# Altium schematic sheet FDCAN&QSPI.SchDoc: FDCAN & QSPI
size A4; DocumentNumber: MB1246; Revision: B.1; SheetNumber: 11; SheetTotal: 17; Project: STM32H7xxI-EVAL
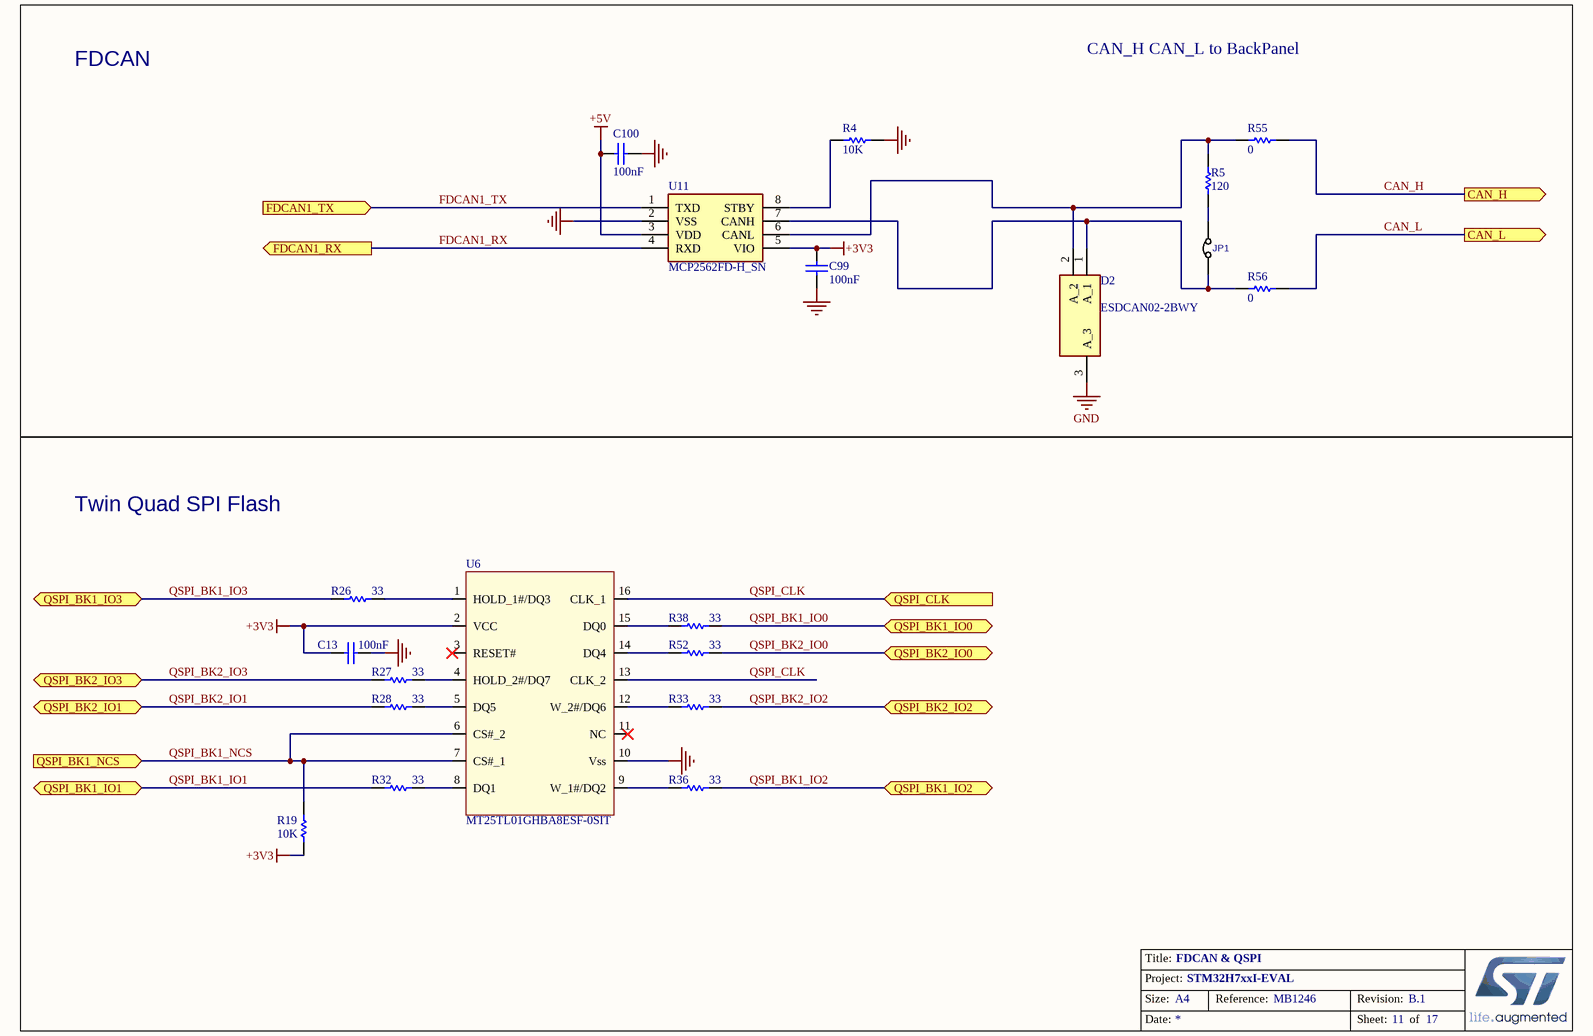
[diagram p0: FDCAN&QSPI.SchDoc]

## Parts
C13  100nF  [C0603E]
C99  100nF  [C0603E]
C100  100nF  [C0603E]
D2  ESDCAN02-2BWY  [SOT65P210X110-3N]
JP1  JMPSOLDER  [HDR1X2]  (value not drawn)
R4  10K  [R0603E]
R5  120  [R0603E]
R19  10K  [R0603E]
R26  33  [R0603E]
R27  33  [R0603E]
R28  33  [R0603E]
R32  33  [R0603E]
R33  33  [R0603E]
R36  33  [R0603E]
R38  33  [R0603E]
R52  33  [R0603E]
R55  0  [R0603E]
R56  0  [R0603E]
U6  MT25TL01GHBA8ESF-0SIT  [SOIC127P1032X265-16N]
U11  MCP2562FD-H_SN  [SOIC127P600X175-8N]

## Ports
CAN_H (out), CAN_L (out), FDCAN1_RX (out), FDCAN1_TX (in), QSPI_BK1_IO0 (bidir), QSPI_BK1_IO1 (bidir), QSPI_BK1_IO2 (bidir), QSPI_BK1_IO3 (bidir), QSPI_BK1_NCS (in), QSPI_BK2_IO0 (bidir), QSPI_BK2_IO1 (bidir), QSPI_BK2_IO2 (bidir), QSPI_BK2_IO3 (bidir), QSPI_CLK (in)

## Nets
+3V3: C13.1 C99.1 R19.2 U6.2(VCC) U11.5(VIO)
+5V: C100.1 U11.3(VDD)
GND: C13.2 C99.2 C100.2 D2.3(A_3) R4.2 U6.10(Vss) U11.2(VSS)
CAN_H: R55.1 ; port CAN_H
CAN_L: R56.1 ; port CAN_L
FDCAN1_RX: U11.4(RXD) ; port FDCAN1_RX
FDCAN1_TX: U11.1(TXD) ; port FDCAN1_TX
QSPI_BK1_IO0: R38.1 ; port QSPI_BK1_IO0
QSPI_BK1_IO1: R32.2 ; port QSPI_BK1_IO1
QSPI_BK1_IO2: R36.1 ; port QSPI_BK1_IO2
QSPI_BK1_IO3: R26.2 ; port QSPI_BK1_IO3
QSPI_BK1_NCS: R19.1 U6.6(CS#_2) U6.7(CS#_1) ; port QSPI_BK1_NCS
QSPI_BK2_IO0: R52.1 ; port QSPI_BK2_IO0
QSPI_BK2_IO1: R28.2 ; port QSPI_BK2_IO1
QSPI_BK2_IO2: R33.1 ; port QSPI_BK2_IO2
QSPI_BK2_IO3: R27.2 ; port QSPI_BK2_IO3
QSPI_CLK: U6.13(CLK_2) U6.16(CLK_1) ; port QSPI_CLK
NetD2_1: D2.1(A_1) JP1.1 R56.2 U11.7(CANH)
NetD2_2: D2.2(A_2) R5.2 R55.2 U11.6(CANL)
NetJP1_2: JP1.2 R5.1
NetR4_1: R4.1 U11.8(STBY)
NetR26_1: R26.1 U6.1(HOLD_1#/DQ3)
NetR27_1: R27.1 U6.4(HOLD_2#/DQ7)
NetR28_1: R28.1 U6.5(DQ5)
NetR32_1: R32.1 U6.8(DQ1)
NetR33_2: R33.2 U6.12(W_2#/DQ6)
NetR36_2: R36.2 U6.9(W_1#/DQ2)
NetR38_2: R38.2 U6.15(DQ0)
NetR52_2: R52.2 U6.14(DQ4)

Not connected (* = marked no-connect by the designer): U6 3(RESET#)* 11(NC)*

## Notes on the sheet
- FDCAN
- CAN_H CAN_L to BackPanel
- Twin Quad SPI Flash
- Title:
- Project:
- Size:
- Date:
- A4
- Reference:
- Sheet:
- Revision:
- of

## Library data of the parts
C13 = Cap: Capacitor; Value: 10nF; Ordered by: Subcon; Published: 8-Jun-2000; Revision: July-2002: Re-released for DXP Platform.; Publisher: Altium Limited
C99 C100 = Cap: Capacitor; Value: 10nF; Published: 8-Jun-2000; Revision: July-2002: Re-released for DXP Platform.; Publisher: Altium Limited
D2 = ESDCAN02-2BWY: TVS Diode (Bi-directional); Manufacturer_Name: STMicroelectronics; Datasheet Link: https://www.st.com/resource/en/datasheet/esdcan02-2bwy.pdf; Height: 1.1mm; Manufacturer_Part_Number: ESDCAN02-2BWY; Mouser Part Number: 511-ESDCAN02-2BWY; Mouser Price/Stock: https://www.mouser.co.uk/ProductDetail/STMicroelectronics/ESDCAN02-2BWY?qs=FqY30PPN9V14rBXzBYhRkA%3D%3D; Arrow Part Number: ESDCAN02-2BWY; Arrow Price/Stock: https://www.arrow.com/en/products/esdcan02-2bwy/stmicroelectronics?region=nac
JP1 = JUMPER_SOLDER: JUMPER, HEADER 2PIN; MANF: MANF; MANF_P#: MANF_P#; VALUE: JMPSOLDER
R4 R26-R28 R32 R33 R36 R38 R52 = Res1: Resistor; Value: 1K; Published: 8-Jun-2000; Revision: July-2002: Re-released for DXP Platform.; Publisher: Altium Limited
R5 R55 R56 = res1: Resistor; Value: 1K; Published: 8-Jun-2000; Revision: July-2002: Re-released for DXP Platform.; Publisher: Altium Limited
R19 = res1: Resistor; Value: 1K; Ordered by: Subcon; Published: 8-Jun-2000; Revision: July-2002: Re-released for DXP Platform.; Publisher: Altium Limited
U6 = MT25TL01GHBA8ESF-0SIT: Serial NOR Flash Memory; ECCN_US/EU: 3A991
U11 = MCP2562FD-H_SN: Integrated Circuit; Manufacturer_Name: Microchip; Manufacturer_Part_Number: MCP2562FD-H/SN; Datasheet Link: http://www.microchip.com/mymicrochip/filehandler.aspx?ddocname=en568915; Height: 1.75mm; Mouser Part Number: 579-MCP2562FD-H/SN; Mouser Price/Stock: https://www.mouser.co.uk/ProductDetail/Microchip-Technology/MCP2562FD-H-SN?qs=YlpJWyuQ3POk3KZHoNA6vA%3D%3D; Arrow Part Number: MCP2562FD-H/SN; Arrow Price/Stock: https://www.arrow.com/en/products/mcp2562fd-hsn/microchip-technology?region=nac